# EAGLE design PRO30 (EAGLE 9.3.1)

## Sheet 1 of 2
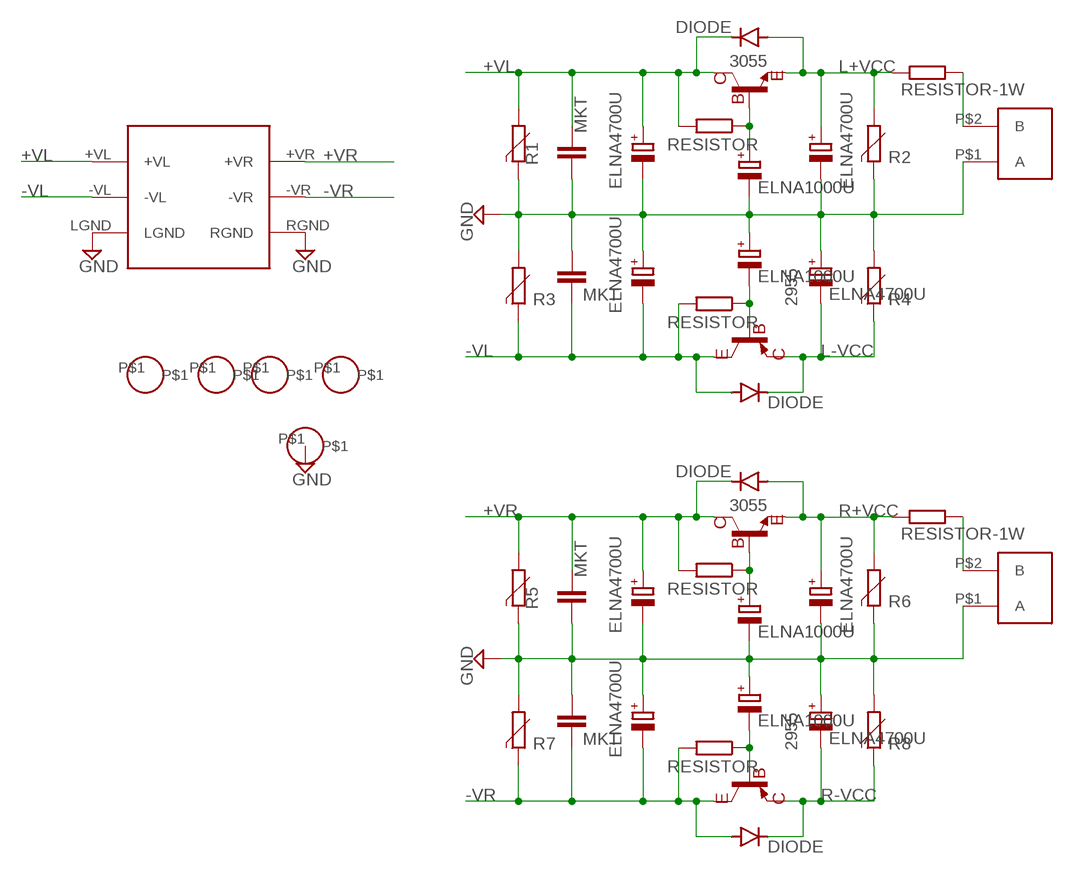
[diagram p0: schematic, sheet 1]

### Parts
R1  NTC  [NTC]
R2  NTC  [NTC]
R3  NTC  [NTC]
R4  NTC  [NTC]
R5  NTC  [NTC]
R6  NTC  [NTC]
R7  NTC  [NTC]
R8  NTC  [NTC]
U$1  INPUT  [INPUT]
U$3  ELNA4700U  [4700U]
U$5  ELNA4700U  [4700U]
U$6  ELNA4700U  [4700U]
U$7  ELNA4700U  [4700U]
U$9  ELNA4700U  [4700U]
U$10  ELNA4700U  [4700U]
U$12  ELNA1000U  [1000U]
U$16  ELNA1000U  [1000U]
U$24  2955  [POWER_TRANS]
U$26  3055  [POWER_TRANS]
U$28  DIODE  [DIODE]
U$29  DIODE  [DIODE]
U$30  MKT  [NTC]
U$34  MKT  [NTC]
U$40  RESISTOR  [RESISTOR]
U$41  OUT2  [OUT2"]
U$42  RESISTOR-1W  [RESISTOR-1W]
U$43  RESISTOR  [RESISTOR]
U$83  ELNA4700U  [4700U]
U$84  ELNA4700U  [4700U]
U$85  ELNA1000U  [1000U]
U$86  ELNA1000U  [1000U]
U$87  2955  [POWER_TRANS]
U$88  3055  [POWER_TRANS]
U$89  DIODE  [DIODE]
U$90  DIODE  [DIODE]
U$91  MKT  [NTC]
U$92  MKT  [NTC]
U$93  RESISTOR  [RESISTOR]
U$94  OUT2  [OUT2"]
U$95  RESISTOR-1W  [RESISTOR-1W]
U$96  RESISTOR  [RESISTOR]
U$101  HOLE  [HOLE]
U$102  HOLE  [HOLE]
U$106  HOLE  [HOLE]
U$107  HOLE  [HOLE]
U$108  HOLE  [HOLE]

### Nets
+VL: R1.2 U$1.+VL U$3.+ U$26.C U$28.C U$30.1 U$40.P$2
+VR: R5.2 U$1.+VR U$9.+ U$88.C U$89.C U$91.1 U$93.P$2
-VL: R3.1 U$1.-VL U$7.- U$24.C U$29.A U$34.2 U$43.P$2
-VR: R7.1 U$1.-VR U$84.- U$87.C U$90.A U$92.2 U$96.P$2
GND: R1.1 R2.1 R3.2 R4.2 R5.1 R6.1 R7.2 R8.2 U$1.LGND U$1.RGND U$3.- U$5.+ U$6.- U$7.+ U$9.- U$10.+ U$12.- U$16.+ U$30.2 U$34.1 U$41.P$1(A) U$83.- U$84.+ U$85.- U$86.+ U$91.2 U$92.1 U$94.P$1(A) U$108.P$1 ; also sheet 2
L+VCC: R2.2 U$6.+ U$26.E U$28.A U$42.P$1 ; also sheet 2
L-VCC: R4.1 U$5.- U$24.E U$29.C ; also sheet 2
N$1: U$85.+ U$88.B U$93.P$1
N$3: U$12.+ U$26.B U$40.P$1
N$4: U$41.P$2(B) U$42.P$2
N$6: U$16.- U$24.B U$43.P$1
N$7: U$94.P$2(B) U$95.P$2
N$38: U$86.- U$87.B U$96.P$1
R+VCC: R6.2 U$83.+ U$88.E U$89.A U$95.P$1 ; also sheet 2
R-VCC: R8.1 U$10.- U$87.E U$90.C ; also sheet 2
Unconnected: U$101.P$1 U$102.P$1 U$106.P$1 U$107.P$1

## Sheet 2 of 2
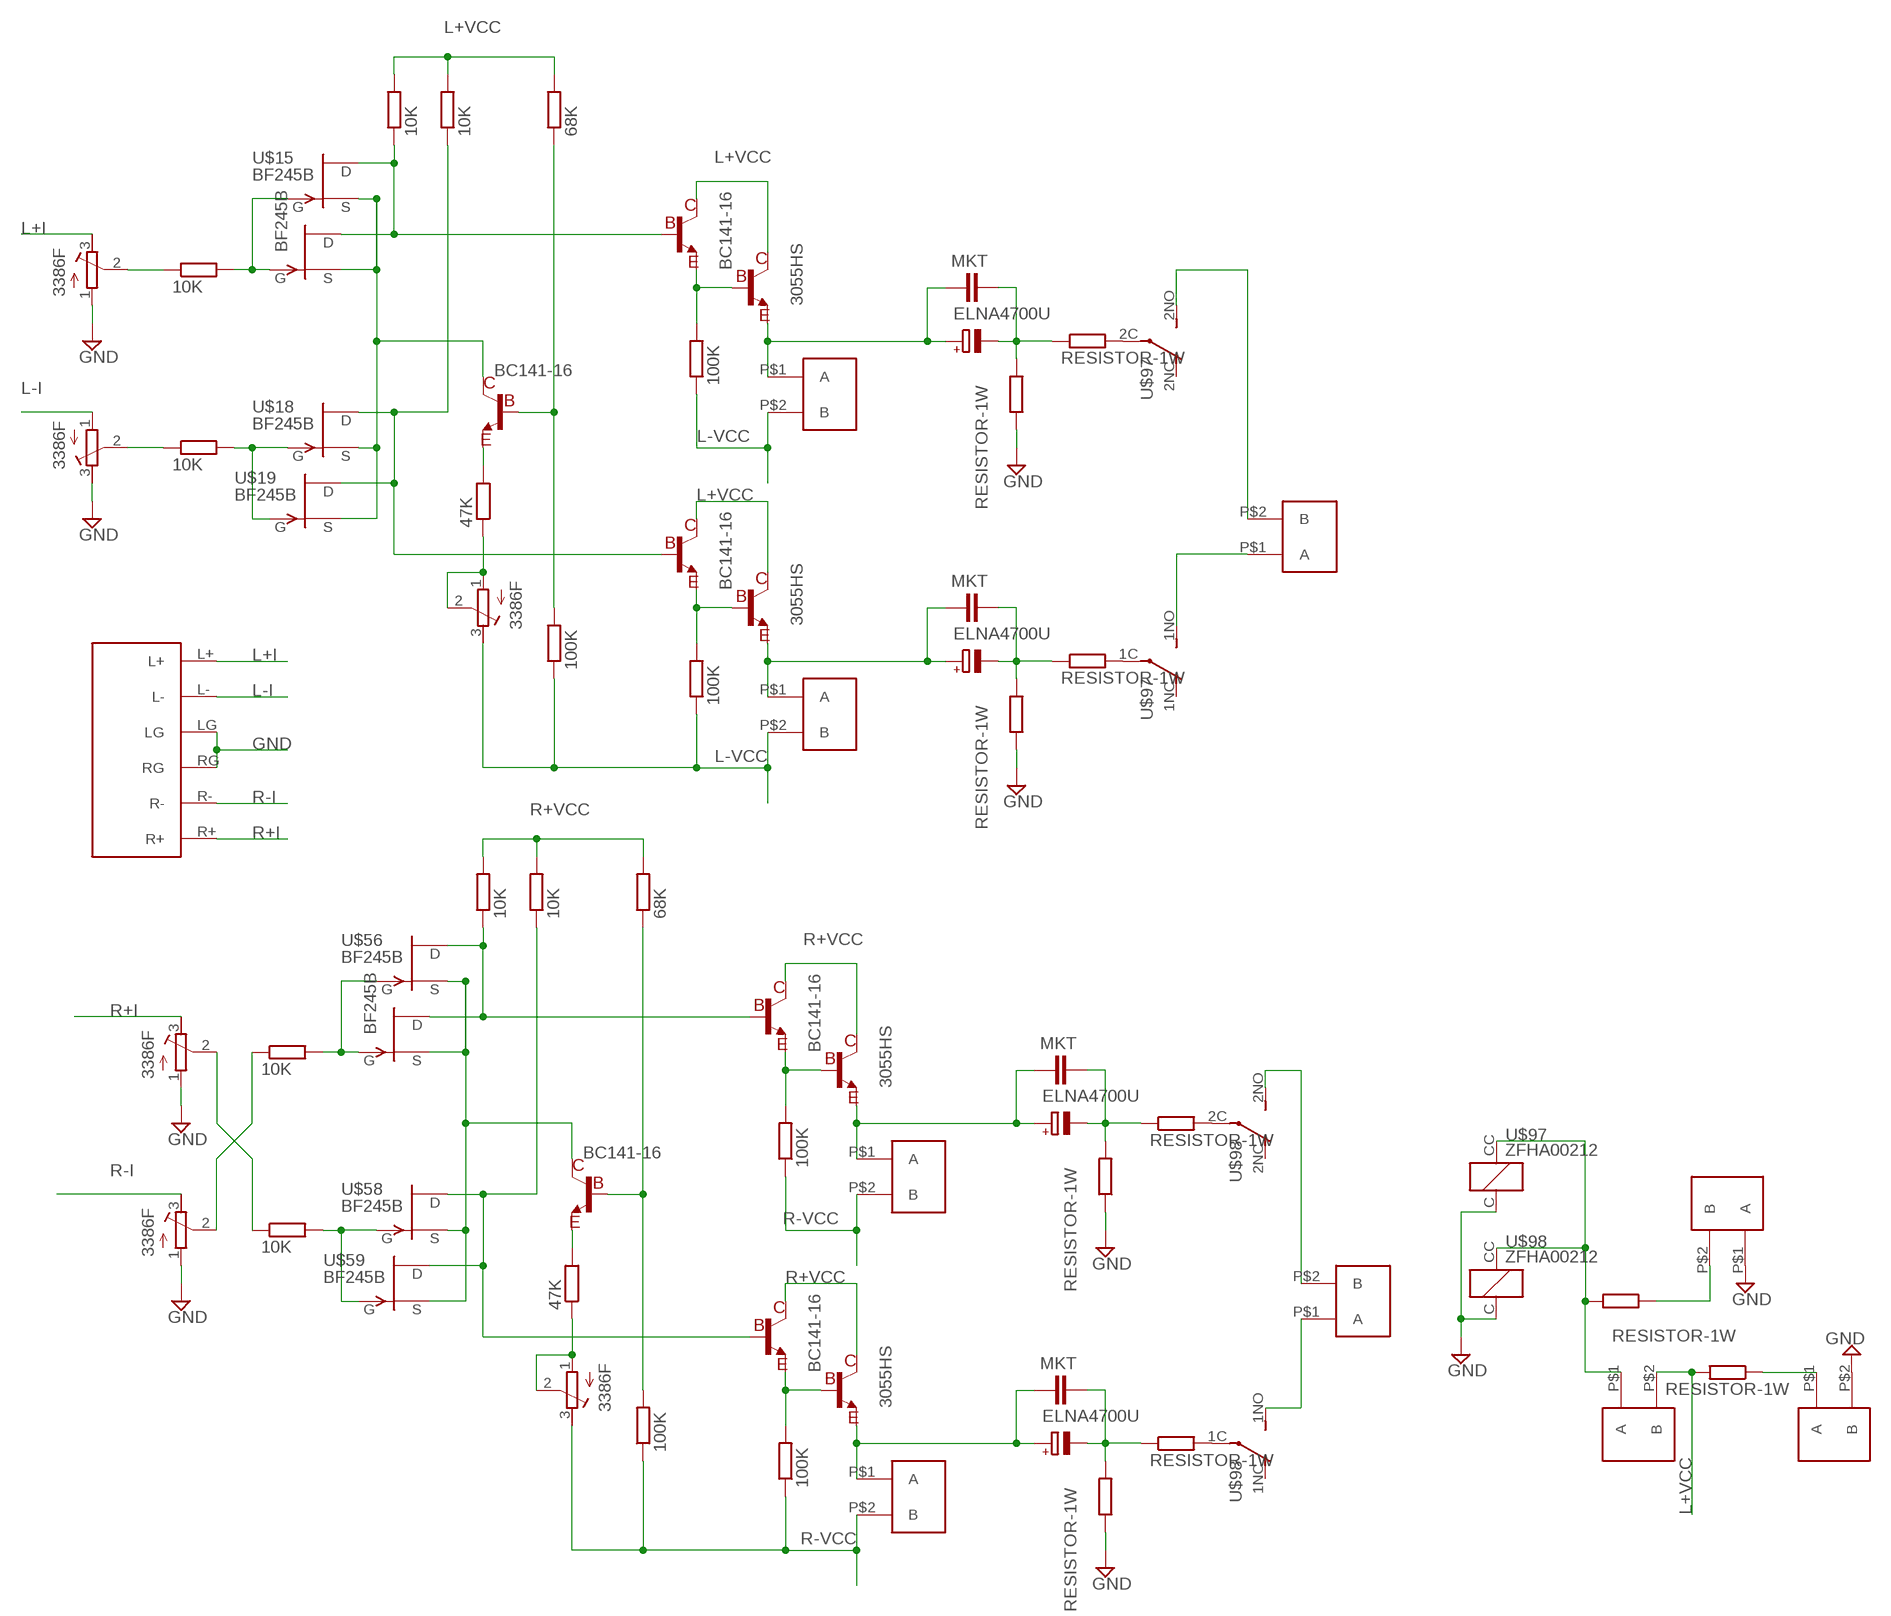
[diagram p1: schematic, sheet 2]

### Parts
DN>L  OUT2  [OUT2"]
DP_SW  OUT2  [OUT2"]
U$2  AUDIO_INPUT  [AUDIO_INPUT]
U$4  3386F  [3386]
U$8  3386F  [3386]
U$11  10K  RESISTOR  [RESISTOR]
U$13  68K  RESISTOR  [RESISTOR]
U$14  BC141-16  [TO39]
U$15  BF245B  [TO39]
U$17  BF245B  [TO39]
U$18  BF245B  [TO39]
U$19  BF245B  [TO39]
U$20  10K  RESISTOR  [RESISTOR]
U$21  10K  RESISTOR  [RESISTOR]
U$22  BC141-16  [TO39]
U$23  BC141-16  [TO39]
U$25  10K  RESISTOR  [RESISTOR]
U$27  47K  RESISTOR  [RESISTOR]
U$31  3386F  [3386]
U$32  3055HS  [POWER_TRANS_WHS]
U$33  3055HS  [POWER_TRANS_WHS]
U$35  OUT3  [OUT3"]
U$36  ELNA4700U  [4700U]
U$37  MKT  [NTC]
U$38  RESISTOR-1W  [RESISTOR-1W]
U$39  RESISTOR-1W  [RESISTOR-1W]
U$44  OUT3  [OUT3"]
U$45  ELNA4700U  [4700U]
U$46  MKT  [NTC]
U$47  RESISTOR-1W  [RESISTOR-1W]
U$48  RESISTOR-1W  [RESISTOR-1W]
U$49  100K  RESISTOR  [RESISTOR]
U$50  100K  RESISTOR  [RESISTOR]
U$51  100K  RESISTOR  [RESISTOR]
U$52  3386F  [3386]
U$53  3386F  [3386]
U$54  10K  RESISTOR  [RESISTOR]
U$55  BC141-16  [TO39]
U$56  BF245B  [TO39]
U$57  BF245B  [TO39]
U$58  BF245B  [TO39]
U$59  BF245B  [TO39]
U$60  10K  RESISTOR  [RESISTOR]
U$61  BC141-16  [TO39]
U$62  47K  RESISTOR  [RESISTOR]
U$63  3386F  [3386]
U$64  3055HS  [POWER_TRANS_WHS]
U$65  OUT3  [OUT3"]
U$66  ELNA4700U  [4700U]
U$67  MKT  [NTC]
U$68  RESISTOR-1W  [RESISTOR-1W]
U$69  RESISTOR-1W  [RESISTOR-1W]
U$70  BC141-16  [TO39]
U$71  3055HS  [POWER_TRANS_WHS]
U$72  OUT3  [OUT3"]
U$73  ELNA4700U  [4700U]
U$74  MKT  [NTC]
U$75  RESISTOR-1W  [RESISTOR-1W]
U$76  RESISTOR-1W  [RESISTOR-1W]
U$77  100K  RESISTOR  [RESISTOR]
U$78  100K  RESISTOR  [RESISTOR]
U$79  100K  RESISTOR  [RESISTOR]
U$80  68K  RESISTOR  [RESISTOR]
U$81  10K  RESISTOR  [RESISTOR]
U$82  10K  RESISTOR  [RESISTOR]
U$97  ZFHA00212  [ZFHA002]
U$98  ZFHA00212  [ZFHA002]
U$99  RESISTOR-1W  [RESISTOR-1W]
U$100  RESISTOR-1W  [RESISTOR-1W]
U$103  OUT2  [OUT2"]
U$104  OUT3  [OUT3"]
U$105  OUT3  [OUT3"]

### Nets
GND: DN>L.P$2(B) U$2.LG U$2.RG U$4.1 U$8.3 U$38.P$1 U$47.P$1 U$52.1 U$53.1 U$68.P$1 U$75.P$1 U$97.C U$98.C U$103.P$1(A) ; also sheet 1
L+I: U$2.L+ U$4.3
L+VCC: DP_SW.P$2(B) U$13.P$2 U$20.P$2 U$22.C/G(C) U$23.C/G(C) U$25.P$2 U$32.C U$33.C U$99.P$2 ; also sheet 1
L-I: U$2.L- U$8.1
L-VCC: U$31.3 U$35.P$2(B) U$44.P$2(B) U$49.P$1 U$50.P$1 U$51.P$1 ; also sheet 1
N$2: U$4.2 U$11.P$1
N$5: U$11.P$2 U$15.C/G(G) U$17.C/G(G)
N$8: U$15.E/D(D) U$17.E/D(D) U$22.B/S(B) U$25.P$1
N$9: U$14.C/G(C) U$15.B/S(S) U$17.B/S(S) U$18.B/S(S) U$19.B/S(S)
N$10: U$13.P$1 U$14.B/S(B) U$49.P$2
N$11: U$8.2 U$21.P$1
N$12: U$18.C/G(G) U$19.C/G(G) U$21.P$2
N$13: U$52.2 U$60.P$1
N$14: U$54.P$2 U$56.C/G(G) U$57.C/G(G)
N$15: U$14.E/D(E) U$27.P$2
N$16: U$27.P$1 U$31.1 U$31.2
N$17: U$22.E/D(E) U$33.B U$51.P$2
N$18: U$18.E/D(D) U$19.E/D(D) U$20.P$1 U$23.B/S(B)
N$19: U$32.E U$44.P$1(A) U$45.+ U$46.1
N$20: U$33.E U$35.P$1(A) U$36.+ U$37.1
N$21: U$36.- U$37.2 U$38.P$2 U$39.P$1
N$22: U$45.- U$46.2 U$47.P$2 U$48.P$1
N$23: U$56.E/D(D) U$57.E/D(D) U$61.B/S(B) U$82.P$1
N$24: U$23.E/D(E) U$32.B U$50.P$2
N$25: U$55.C/G(C) U$56.B/S(S) U$57.B/S(S) U$58.B/S(S) U$59.B/S(S)
N$26: U$58.C/G(G) U$59.C/G(G) U$60.P$2
N$27: U$53.2 U$54.P$1
N$28: U$55.E/D(E) U$62.P$2
N$29: U$62.P$1 U$63.1 U$63.2
N$30: U$64.E U$65.P$1(A) U$66.+ U$67.1
N$31: U$66.- U$67.2 U$68.P$2 U$69.P$1
N$32: U$61.E/D(E) U$64.B U$79.P$2
N$33: U$58.E/D(D) U$59.E/D(D) U$70.B/S(B) U$81.P$1
N$34: U$71.E U$72.P$1(A) U$73.+ U$74.1
N$35: U$73.- U$74.2 U$75.P$2 U$76.P$1
N$36: U$70.E/D(E) U$71.B U$78.P$2
N$37: U$55.B/S(B) U$77.P$2 U$80.P$1
N$39: U$48.P$2 U$97.1C(C)
N$40: U$39.P$2 U$97.2C(C)
N$41: U$97.1NO(NO) U$104.P$1(A)
N$42: U$97.2NO(NO) U$104.P$2(B)
N$43: U$76.P$2 U$98.1C(C)
N$44: U$69.P$2 U$98.2C(C)
N$45: U$98.2NO(NO) U$105.P$2(B)
N$46: U$98.1NO(NO) U$105.P$1(A)
N$47: DP_SW.P$1(A) U$97.CC(CT) U$98.CC(CT) U$100.P$2
N$48: U$100.P$1 U$103.P$2(B)
N$50: DN>L.P$1(A) U$99.P$1
R+I: U$2.R+ U$52.3
R+VCC: U$61.C/G(C) U$64.C U$70.C/G(C) U$71.C U$80.P$2 U$81.P$2 U$82.P$2 ; also sheet 1
R-I: U$2.R- U$53.3
R-VCC: U$63.3 U$65.P$2(B) U$72.P$2(B) U$77.P$1 U$78.P$1 U$79.P$1 ; also sheet 1
Unconnected: U$97.1NC(NC) U$97.2NC(NC) U$98.1NC(NC) U$98.2NC(NC)

## Library data of the parts
DN>L DP_SW U$35 U$41 U$44 U$65 U$72 U$94 U$103-U$105 = pro30:OUT
R1-R8 = pro30:NTC
U$1 = pro30:INPUT
U$2 = pro30:AUDIO_INPUT
U$3 U$5-U$7 U$9 U$10 U$12 U$16 U$36 U$45 U$66 U$73 U$83-U$86 = pro30:ELNA
U$4 U$8 U$31 U$52 U$53 U$63 = pro30:3386F
U$11 U$13 U$20 U$21 U$25 U$27 U$40 U$43 U$49-U$51 U$54 U$60 U$62 U$77-U$82 U$93 U$96 = pro30:RESISTOR
U$14 U$22 U$23 U$55 U$61 U$70 = pro30:BC141-16
U$15 U$17-U$19 U$56-U$59 = pro30:BF245B
U$24 U$87 = pro30:2955
U$26 U$32 U$33 U$64 U$71 U$88 = pro30:3055
U$28 U$29 U$89 U$90 = pro30:DIODE
U$30 U$34 U$37 U$46 U$67 U$74 U$91 U$92 = pro30:MKT
U$38 U$39 U$42 U$47 U$48 U$68 U$69 U$75 U$76 U$95 U$99 U$100 = pro30:RESISTOR-1W
U$97 U$98 = pro30:ZFHA00212
U$101 U$102 U$106-U$108 = pro30:HOLE

## Board
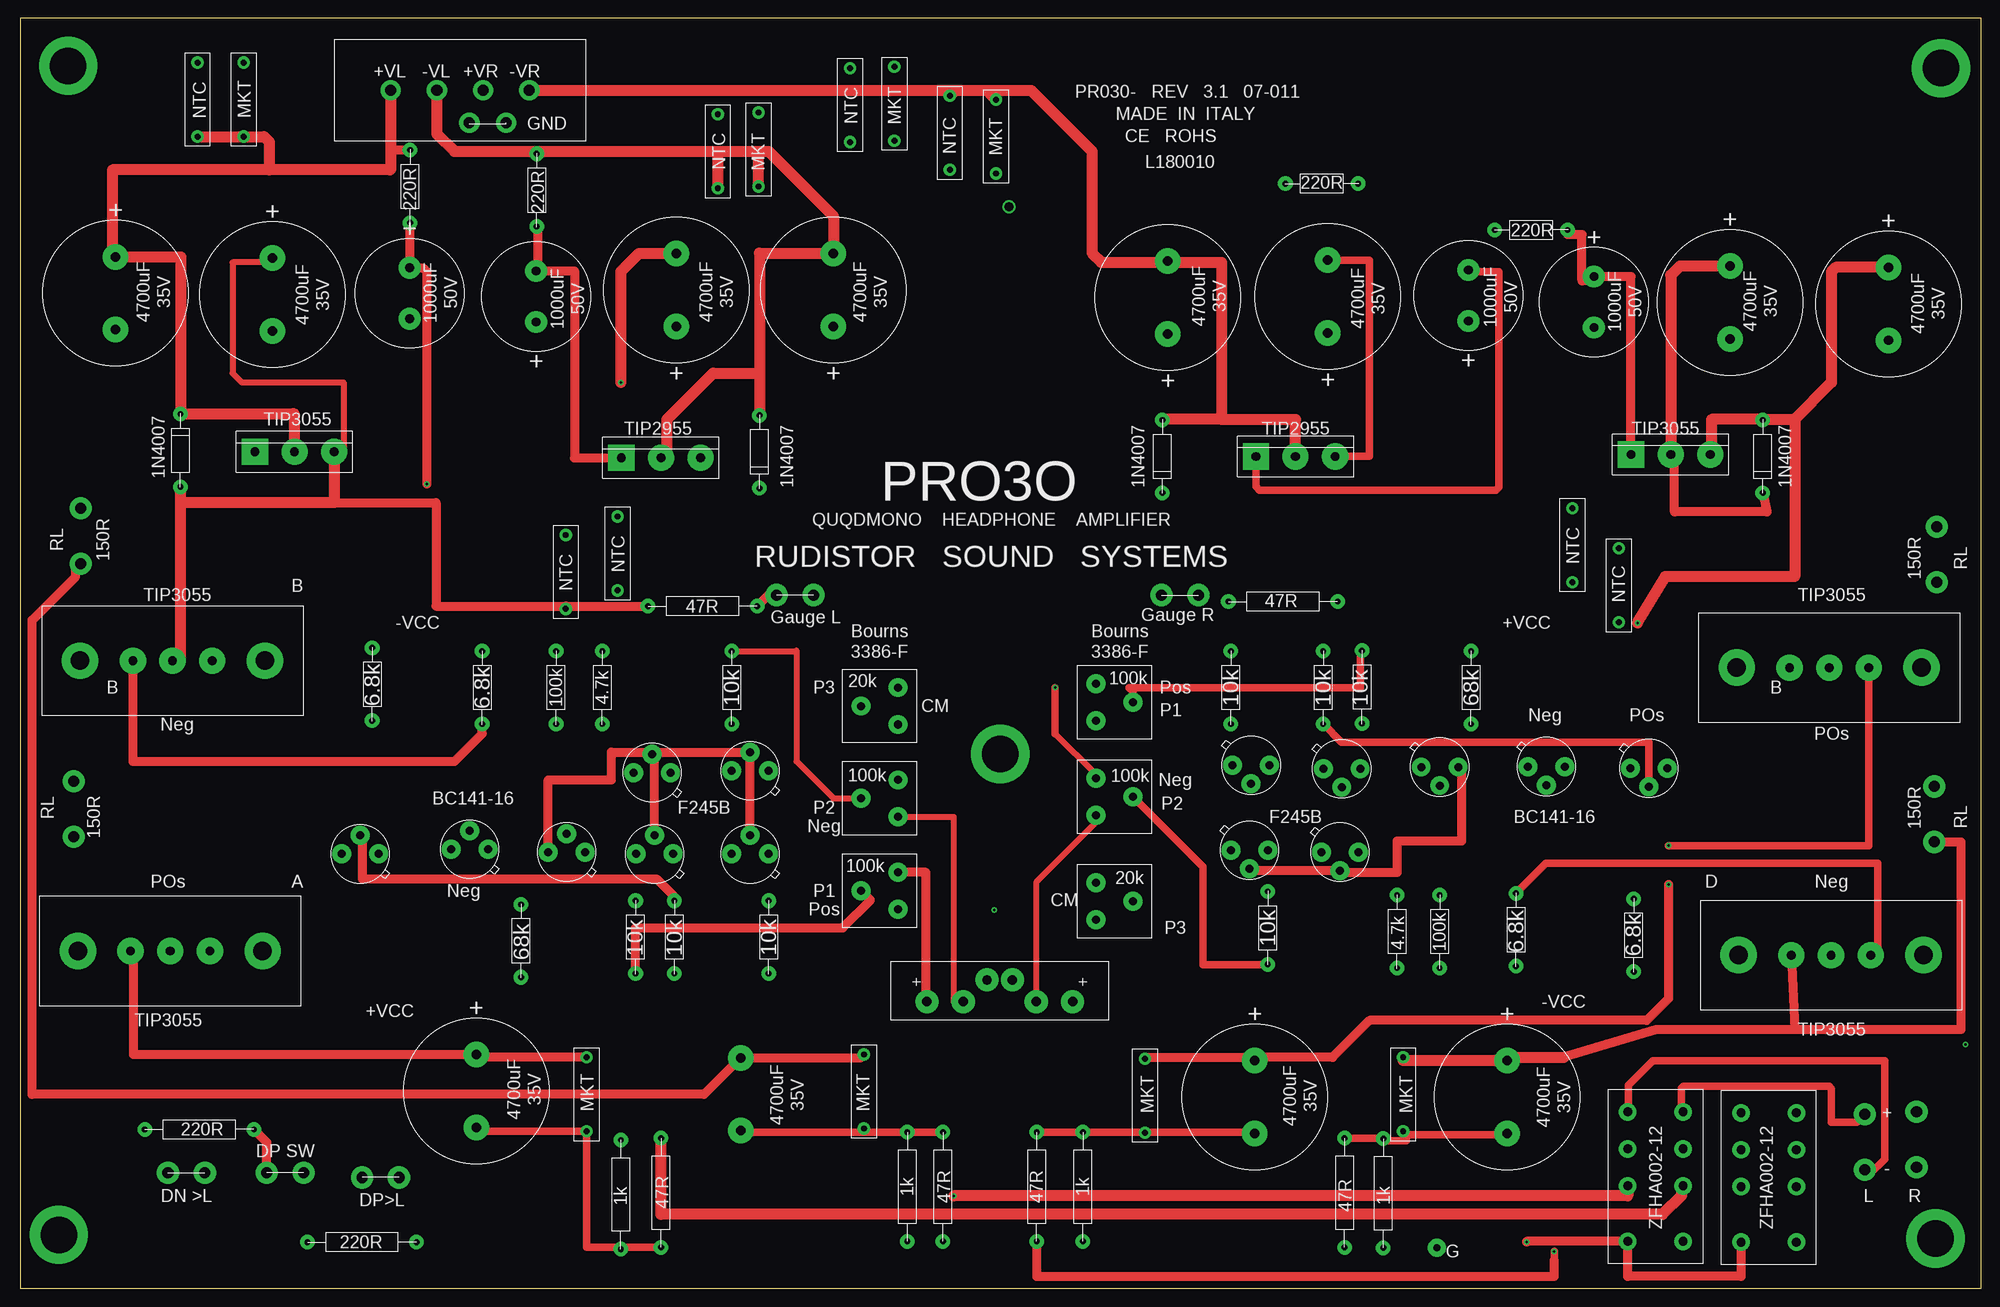
[diagram p2: board, top side]
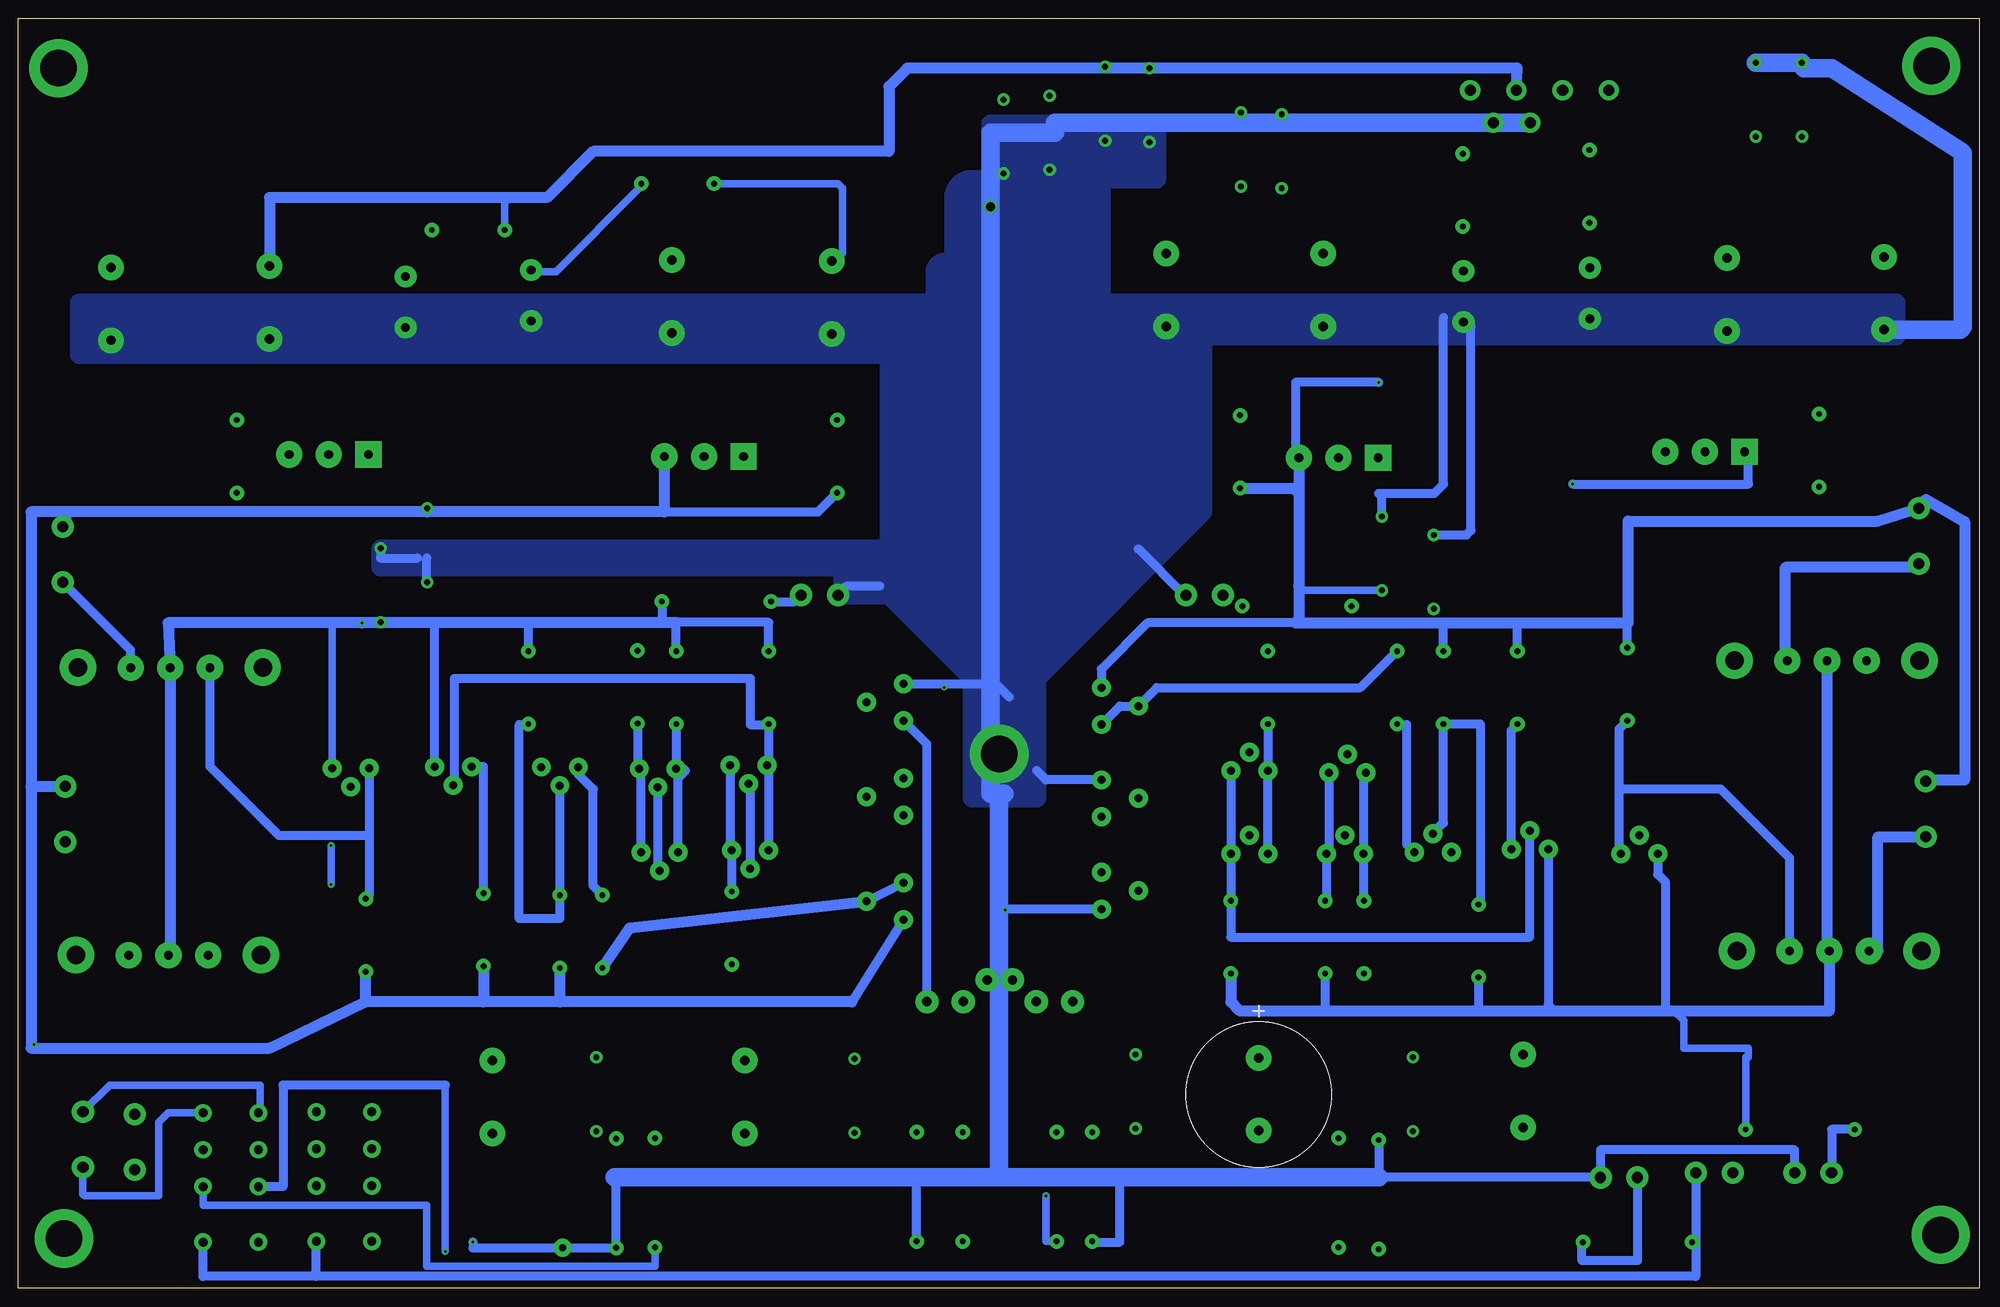
[diagram p3: board, bottom side, seen from below]

Size 269.5 x 174.5 mm. Coordinates in mm from the lower left corner, seen from the top.
Outline: 0,0 269.5,0 269.5,174.5 0,174.5 0,0
Copper layers (1*16): Top 0.035mm / dielectric 1.5mm / Bottom 0.035mm
Design rules "default": minimum track width 6mil, minimum drill 0.35mm, track to track 6mil, track to pad 6mil, pad to pad 6mil, via to via 6mil, smd to smd 6mil, copper to edge 40mil, drill to drill 6mil, minimum pad ring 10mil, minimum via ring 8mil, stop-mask expansion 4mil, vias tented up to drill 0mil, thermal gap 10mil

### Footprints (pad centres in the part's own frame; a part is rotated, then mirrored left to right if it is on the bottom)
OUT2" = drill 1.524 pad 3.048: P$1 0,0; P$2 5.08,0
NTC = drill 0.813 pad 1.676: 1 -5.08,0; 2 5.08,0
INPUT = drill 1.524 pad 2.794: +VL -9.525,0; +VR 3.175,0; -VL -3.175,0; -VR 9.525,0; LGND 1.27,-4.445; RGND 6.35,-4.445
AUDIO_INPUT = drill 1.3 pad 3.2: L+ -10,-1.5; L- -5,-1.5; LG -1.75,1.5; R+ 10,-1.5; R- 5,-1.5; RG 1.75,1.5
4700U = drill 1.3 pad 3.5: + 0,5; - 0,-5
3386 = drill 1.1 pad 2.6: 1 2.54,2.54; 2 0,-2.54; 3 -2.54,2.54
RESISTOR = drill 0.8 pad 2: P$1 -5,0; P$2 5,0
1000U = drill 1.2 pad 3: + 0,3.5; - 0,-3.5
TO39 = drill 1.1 pad 2.6: B/S 2.54,0; C/G 0,2.54; E/D 0,-2.54
POWER_TRANS = drill 1.2 pad 3.6 square: B -5.45,0 | drill 1.2 pad 3.6: C 0,0; E 5.45,0
DIODE = drill 0.8 pad 2: A 5,0; C -5,0
POWER_TRANS_WHS = drill 1.2 pad 3.6: B -5.45,0; C 0,0; E 5.45,0 | drill 2.54 pad 5: P$4 -12.7,0; P$5 12.7,0
OUT3" = drill 1.524 pad 3.048: P$1 0,0; P$2 7.62,0
RESISTOR-1W = drill 0.8 pad 2: P$1 -7.5,0; P$2 7.5,0
ZFHA002 = drill 1.2 pad 2.4: 1C -1.27,3.81; 1NC 3.81,3.81; 1NO 8.89,3.81; 2C -1.27,-3.81; 2NC 3.81,-3.81; 2NO 8.89,-3.81; C -8.89,3.81; CC -8.89,-3.81
HOLE = drill 5 pad 8: P$1 0,0

### Placement (x,y rotation side)
DN>L  20.32,15.88 0 top
DP_SW  38.99,15.88 180 top
R1  24.38,163.32 270 top
R2  74.99,98.42 270 top
R3  101.47,156.46 90 top
R4  82.11,100.97 90 top
R5  120.14,162.75 90 top
R6  219.71,96.58 270 top
R7  134.11,158.24 270 top
R8  213.3,102.11 270 top
U$1  60.45,164.59 0 top
U$2  134.62,40.89 0 top
U$3  13.14,136.72 0 top
U$4  118.11,54.61 270 top
U$5  90.17,137.16 180 top
U$6  34.67,136.53 0 top
U$7  111.76,137.16 180 top
U$8  118.11,67.31 270 top
U$9  234.95,135.45 0 top
U$10  179.71,136.27 180 top
U$11  84.58,48.26 90 top
U$12  53.53,136.72 0 top
U$13  68.83,47.75 270 top
U$14  75.12,59.94 90 top
U$15  87.19,59.69 90 top
U$16  70.93,136.27 180 top
U$17  86.87,70.87 90 top
U$18  100.33,59.69 90 top
U$19  100.33,71.12 90 top
U$20  102.87,48.26 270 top
U$21  97.79,82.55 270 top
U$22  46.74,59.69 90 top
U$23  61.79,60.33 90 top
U$24  88.07,114.11 0 top
U$25  89.92,48.26 270 top
U$26  37.72,114.94 0 top
U$27  80.01,82.55 270 top
U$28  22.03,115.13 270 top
U$29  101.6,114.94 90 top
U$30  30.73,163.32 90 top
U$31  118.11,80.01 270 top
U$32  20.95,86.23 0 top
U$33  20.64,46.35 180 top
U$34  95.89,156.21 270 top
U$35  7.37,62.04 90 top
U$36  62.67,27.11 0 top
U$37  77.85,26.67 270 top
U$38  82.55,12.89 270 top
U$39  88.07,13.14 90 top
U$40  53.59,151.38 90 top
U$41  109.03,95.25 180 top
U$42  93.79,93.73 0 top
U$43  70.99,150.88 90 top
U$44  8.32,99.57 90 top
U$45  99.06,26.67 0 bottom
U$46  115.95,27.05 270 top
U$47  121.92,13.97 90 top
U$48  126.81,13.97 270 top
U$49  73.66,82.55 270 top
U$50  63.5,82.55 270 top
U$51  48.39,82.99 270 top
U$52  150.37,80.52 90 top
U$53  150.37,67.56 90 top
U$54  171.45,49.53 90 top
U$55  195.07,71.63 270 top
U$56  168.91,60.2 270 top
U$57  169.16,71.88 270 top
U$58  181.61,71.37 270 top
U$59  181.36,59.94 270 top
U$60  184.4,82.61 270 top
U$61  209.74,71.69 270 top
U$62  189.23,49.02 90 top
U$63  150.37,53.21 90 top
U$64  248.86,45.78 180 top
U$65  263.02,61.34 90 top
U$66  204.34,26.29 0 top
U$67  190.06,26.67 270 top
U$68  187.32,13.08 90 top
U$69  181.99,13.14 270 top
U$70  223.84,71.44 270 top
U$71  248.6,85.28 0 top
U$72  263.4,97.03 90 top
U$73  169.67,26.29 0 top
U$74  154.56,26.48 270 top
U$75  146.05,13.97 90 top
U$76  139.7,13.97 270 top
U$77  195.07,49.02 90 top
U$78  221.74,48.51 90 top
U$79  205.55,49.28 90 top
U$80  199.39,82.55 90 top
U$81  179.07,82.55 90 top
U$82  166.37,82.55 90 top
U$83  256.73,135.25 0 top
U$84  157.73,136.14 180 top
U$85  216.28,135.51 0 top
U$86  199.01,136.4 180 top
U$87  175.26,114.3 0 top
U$88  226.82,114.55 0 top
U$89  239.46,114.3 90 top
U$90  156.97,114.3 90 top
U$91  114.05,162.56 270 top
U$92  127.76,158.75 90 top
U$93  207.65,145.41 180 top
U$94  156.84,95.25 0 top
U$95  173.55,94.36 180 top
U$96  178.88,151.76 180 top
U$97  224.73,15.37 90 top
U$98  240.28,15.24 90 top
U$99  24.64,21.84 0 top
U$100  46.99,6.35 180 top
U$101  263.21,6.86 0 top
U$102  6.6,167.96 0 top
U$103  52.07,15.24 180 top
U$104  253.49,16.32 90 top
U$105  260.6,24.26 270 top
U$106  5.33,7.37 0 top
U$107  263.97,167.64 0 bottom
U$108  134.68,73.41 0 top

### Tracks (layer width: path | path; a pad name or v marks a point on that pad's centre or on a via)
+VL
  Top 1.27: U$40.P$2 50.93,156.38 50.93,156.21 | U$3.+ 13.14,142.24 12.7,142.24
  Top 1.54: U$1.+VL 50.93,156.21 50.93,153.8 50.8,153.67 34.29,153.67 | 34.29,153.67 12.7,153.67 12.7,142.24 13.97,142.24 | R1.2 U$30.1 33.53,158.24 34.29,157.48 34.29,153.67 | U$26.C 37.72,120.08 37.59,120.21 37.51,120.13 U$28.C 22.1,120.13 22.1,141.72 U$3.+
+VR
  Top 1.016: U$88.C 227.08,114.55 227.33,114.3
  Top 1.27: U$89.C 240.03,106.68 227.33,106.68 227.33,114.3 227.33,115.57
  Top 1.54: U$9.+ 228.08,140.45 226.82,139.19 U$88.C
  Bottom 0.203: R5.2 120.14,167.64 119.38,167.64
  Bottom 1.016: U$91.1 115.57,167.64 | R5.2 119.95,167.64 | U$93.P$2 202.65,149.15 201.93,149.86
  Bottom 1.54: U$1.+VR 63.5,167.64 115.57,167.64 119.38,167.64 147.32,167.64 149.86,165.1 149.86,156.21 190.5,156.21 196.85,149.86 201.93,149.86 234.95,149.86 U$9.+
-VL
  Top 1.016: U$43.P$2 70.99,156.08 71.12,156.21
  Top 1.54: U$1.-VL 57.28,158.62 59.69,156.21 71.12,156.21 95.25,156.21 | 95.25,156.21 101.6,156.21 | 101.6,156.21 102.87,156.21 111.76,147.32 U$7.- 101.68,142.16 101.6,142.24 101.6,125.73 | U$34.2 95.89,155.57 95.25,156.21 | R3.1 101.47,156.08 101.6,156.21 | 101.6,125.73 U$29.A | U$24.C 88.9,114.94 88.9,119.38 95.25,125.73 101.6,125.73
-VR
  Top 1.016: U$84.- 159.85,141.14 160.02,140.97
  Top 1.54: U$1.-VR 128.27,164.59 | 128.27,164.59 133.35,164.59 | 133.35,164.59 138.94,164.59 147.32,156.21 147.32,142.24 148.59,140.97 160.02,140.97 165.1,140.97 165.1,119.38 | U$92.2 128.27,164.34 128.27,164.59 | R7.1 133.35,164.08 133.35,164.59 | U$87.C 175.26,119.38 165.1,119.38 | U$90.A 157.05,119.38 165.1,119.38
  Bottom 1.016: U$96.P$2 156.84,151.76 156.21,151.13 156.21,142.24 157.31,141.14 U$84.-
GND  (via drill 0.35, 1 pad 2.5, 1.2 pad 1.6)
  Top 0.813: U$53.1 147.83,70.61 142.24,76.2
  Top 1.016: 142.24,76.2 v142.24,82.55
  Top 1.27: U$98.C 236.47,1.65 220.92,1.65 U$97.C 207.01,6.48 v207.01,6.35
  Bottom 0.203: v142.24,82.55 142.24,83.06
  Bottom 1.016: R3.2 101.47,160.15 101.6,160.15 | U$34.1 95.89,160.15 95.25,160.15 | U$1.RGND 64.77,160.15 | v194.69,5.59 v194.7,5.58 195.58,5.58
  Bottom 1.27: v207.01,6.35 207.01,5.58 195.58,5.58 U$68.P$1 187.32,15.24 187.58,15.24 | R4.2 82.11,108.78 82.55,109.22 74.93,109.22 73.66,110.49 73.66,133.35 | R2.1 70.48,103.5 69.85,104.14 69.85,132.08 | U$38.P$1 82.55,15.24 | DN>L.P$2 25.4,19.05 52.07,19.05 U$103.P$1 83.82,15.24 | R6.1 219.71,100.33 214.63,100.33 | R8.2 213.36,97.03 213.36,100.33 | U$4.1 134.75,52.07 134.68,52.01 v133.86,52.01 | U$8.3 128.27,69.85 129.54,71.12 | U$94.P$1 155.57,96.52 151.13,96.52 | U$52.1 142.24,83.06 135.13,83.06 133.35,81.28 | U$47.P$1 121.92,6.35 118.11,6.35 118.11,15.24 | U$75.P$1 146.05,15.24 | U$2.LG 134.75,42.39 | U$2.RG 134.75,42.39 | 134.75,42.39 134.75,43.18 | U$41.P$1 109.22,95.25 115.57,101.6
  Bottom 2.54: U$1.LGND 64.77,160.15 95.25,160.15 101.6,160.15 127,160.15 127,158.75 135.89,158.75 v135.89,148.59 135.89,67.94 134.75,67.94 | U$3.- 2.65,131.72 2.29,132.08 2.29,155.96 2.54,156.21 20.32,167.64 24.13,167.64 R1.1 U$30.2 | 133.99,67.94 134.75,67.94 | 187.58,15.24 146.05,15.24 134.75,15.24 | 134.75,67.94 134.75,52.07 134.75,43.18 134.75,15.24 | 82.55,15.24 83.82,15.24 118.11,15.24 134.75,15.24
  pour Bottom (no thermals): 135.89,152.4 138.43,152.4 arc-90 140.97,149.86 140.97,140.97 142.24,140.97 arc-90 143.51,139.7 143.51,135.38 261.11,135.38 261.11,128.27 149.86,128.27 149.86,101.6 219.71,101.6 219.71,99.06 156.21,99.06 156.21,95.25 149.86,95.25 138.43,83.82 138.43,67.31 129.54,67.31 129.54,83.82 106.68,106.68 106.68,130.81 11.43,130.81 11.43,135.38 120.65,135.38 120.65,152.4 113.03,152.4 113.03,160.02 135.89,160.02
L+I
  Top 1.27: U$2.L+ 124.46,39.39 124.46,57.15 U$4.3
L+VCC
  Top 0.813: U$6.+ 34.12,140.97 29.21,140.97 29.21,125.73 30.48,124.46 44.45,124.46 44.45,115.57 43.18,114.3 43.17,114.31 U$26.E
  Top 1.27: 43.17,107.95 57.15,107.95 57.15,93.73 74.99,93.73 | DP_SW.P$2 33.91,20.07 U$99.P$2 | 74.99,93.73 U$42.P$1 | R2.2 74.99,93.73
  Top 1.54: U$28.A 22.04,107.95 | 22.04,107.95 22.04,86.23 U$32.C | U$26.E 43.17,107.95 22.04,107.95
  Bottom 1.016: 41.91,38.1 40.64,36.83 40.64,33.02 31.75,33.02 31.75,31.75 32.14,31.75 U$99.P$2 | U$20.P$2 102.87,43.18
  Bottom 1.27: U$25.P$2 89.92,38.1 | U$13.P$2 68.83,38.1 | U$23.C/G 59.24,38.92 58.42,38.1 | U$22.C/G 44.2,56.9 43.18,55.88 43.18,38.1 | U$33.C 20.64,46.67 20.95,46.99
  Bottom 1.54: U$32.C 20.95,46.99 20.95,45.72 20.32,45.72 | U$33.C 20.64,38.1 41.91,38.1 43.18,38.1 58.42,38.1 68.83,38.1 89.92,38.1 101.6,38.1 102.87,39.37 102.87,43.18
L-I
  Top 0.813: U$8.1 128.27,64.77 128.27,39.37 128.29,39.39 U$2.L-
L-VCC  (via drill 0.35)
  Top 1.54: U$5.- 85.01,142.16 82.55,139.7 v82.55,124.46
  Bottom 1.016: U$35.P$2 7.56,69.85 7.62,69.85 | R4.1 92.89,95.89 93.53,96.52
  Bottom 1.27: v82.55,124.46 93.98,124.46 93.98,114.56 U$24.E | U$51.P$1 48.39,91.44 | 93.98,91.44 114.3,91.44 120.65,85.09 U$31.3 | U$49.P$1 73.66,91.44 | U$50.P$1 63.5,91.44
  Bottom 1.54: U$29.C 94.24,109.94 93.53,109.22 | 7.62,69.85 2.03,69.85 2.03,105.35 7.37,108.39 U$44.P$2 13.97,105.41 48.26,105.41 48.26,91.44 48.39,91.44 63.5,91.44 73.66,91.44 93.98,91.44 93.53,91.89 93.53,96.52 93.53,109.22 | U$24.E 93.53,109.22
N$1
  Top 1.27: U$88.B 221.37,139.01 U$85.+ 216.28,138.43 214.63,138.43 214.63,144.78 212.65,144.78 U$93.P$1
N$2
  Top 1.27: U$11.P$1 84.58,49.53 113.03,49.53 116.84,53.34 U$4.2
N$3  (via drill 0.35)
  Top 1.27: U$40.P$1 53.53,146.32 U$12.+ 55.36,140.22 55.88,139.7 v55.88,110.49
  Bottom 1.27: v55.88,110.49 31.75,110.49 31.75,114.42 U$26.B
N$4
  Top 1.27: U$42.P$2 102.81,95.25 U$41.P$2
N$5
  Bottom 1.27: U$17.C/G 84.64,70.87 U$15.C/G 84.64,53.32 U$11.P$2
N$6
  Top 1.27: U$24.B 76.2,114.11 76.2,139.77 U$16.- 71.12,139.77 71.12,145.75 U$43.P$1
N$7
  Bottom 1.27: U$95.P$2 162.81,94.36 U$94.P$2
N$8
  Top 1.016: U$25.P$1 89.92,53.78
  Top 1.27: U$22.B/S 47.05,61.91 47.05,56.26 87.44,56.26 89.92,53.78
  Bottom 1.016: U$25.P$1 89.72,53.45 89.72,54.61
  Bottom 1.27: U$17.E/D 89.41,59.69 U$15.E/D 89.72,54.61 89.72,53.34
N$9
  Top 1.27: U$14.C/G 72.58,69.85 81.28,69.85 81.28,73.66 86.87,73.66 U$17.B/S 87.19,73.72 87.19,73.66 | 87.19,73.66 U$19.B/S U$18.B/S | U$15.B/S 87.19,73.66
N$10
  Bottom 1.27: U$13.P$1 68.58,52.75 68.58,77.55 U$49.P$2 73.66,63.94 U$14.B/S
N$11
  Top 0.813: U$21.P$1 106.6,87.55 106.68,87.63 106.68,72.39 111.76,67.31 U$8.2
N$12
  Bottom 1.27: U$18.C/G U$19.C/G U$21.P$2
N$13
  Top 1.016: U$52.2 152.91,82.04 152.4,82.55 184.15,82.55 184.15,87.61 U$60.P$1
N$14
  Bottom 1.27: U$57.C/G 171.7,61.21 171.45,60.96 U$56.C/G U$54.P$2
N$15
  Bottom 1.27: U$27.P$2 79.93,77.47 78.74,77.47 78.74,61.02 U$14.E/D
N$16
  Bottom 1.27: U$31.1 118.11,80.01 U$31.2 113.03,82.55 85.09,82.55 80.01,87.63 U$27.P$1
N$17
  Bottom 1.27: U$51.P$2 49.53,76.85 49.53,68.58 | 49.53,68.58 49.53,59.94 U$22.E/D | U$33.B 26.09,59.11 35.56,68.58 49.53,68.58
N$18
  Bottom 1.27: U$19.E/D U$18.E/D U$20.P$1 102.87,48.26 61.78,48.26 U$23.B/S
N$19
  Top 1.27: U$44.P$1 7.62,98.87 7.62,97.79 1.65,91.82 1.65,26.67 93.98,26.67 98.98,31.67 U$45.+ 115.49,31.67 U$46.1
  Bottom 1.016: U$32.E 26.54,86.23 26.67,86.36
  Bottom 1.54: U$44.P$1 8.32,99.06 26.67,99.06 26.67,86.36
N$20
  Top 1.27: U$37.1 63.04,31.75 U$36.+ 15.6,32.11 15.6,46.35 U$33.E 15.19,46.94
  Bottom 1.54: U$33.E 13.97,46.35 13.97,62.04 U$35.P$1
N$21
  Top 1.016: U$39.P$1 82.55,5.64 77.85,5.64 U$37.2 63.5,21.59 63.5,22.11 U$36.-
  Top 1.27: U$38.P$2 82.55,5.64
N$22
  Top 1.016: U$48.P$1 U$47.P$2 115.57,21.47 | 115.57,21.47 97.91,21.47 97.79,21.59 97.87,21.67 U$45.- | U$46.2 115.95,21.85 115.57,21.47
N$23
  Bottom 1.27: U$61.B/S 209.55,69.15 209.55,83.82 168.91,83.82 168.91,77.47 166.37,77.47 | 166.37,77.47 166.37,72.14 | 166.37,72.14 U$56.E/D | U$82.P$1 166.37,77.47 | U$57.E/D 166.37,72.14
N$24
  Top 1.27: U$32.B 15.51,72.39 59.69,72.39 63.5,76.2 U$50.P$2
  Bottom 1.27: U$23.E/D 64.33,76.64 63.5,77.47 U$50.P$2
N$25
  Top 1.27: U$55.C/G 198.12,71.63 198.12,61.47 189.23,61.47 189.23,57.15 181.61,57.15 U$59.B/S 169.16,57.4 U$56.B/S
  Bottom 1.27: U$59.B/S 181.61,57.4 U$58.B/S | U$57.B/S 168.91,69.09 U$56.B/S
N$26
  Bottom 1.27: U$60.P$2 184.4,71.63 U$58.C/G 183.9,71.12 U$59.C/G
N$27
  Top 1.016: U$54.P$1 171.37,44.45 162.56,44.45 162.56,57.91 U$53.2
N$28
  Bottom 1.27: U$62.P$2 190.5,55.29 190.5,68.58 192.53,70.61 U$55.E/D
N$29
  Bottom 1.27: U$63.2 U$63.1
  Bottom 1.54: U$62.P$1 185.42,49.53 U$63.2
N$30
  Top 1.27: U$65.P$1 266.7,61.34 266.7,35.56 243.84,35.56 | 243.84,35.56 224.79,35.56 212.09,31.75 | U$64.E 243.84,35.56 | U$66.+ 204.34,31.62 204.47,31.75
  Top 1.54: U$66.+ 190.06,31.29 U$67.1 | 204.47,31.75 212.09,31.75
N$31
  Top 1.016: U$69.P$1 187.26,20.64 U$68.P$2 187.59,20.32 190.5,20.32 190.5,21.14 | 190.5,21.14 U$67.2 | 190.5,21.14 204.2,21.14 U$66.-
N$32
  Top 1.016: U$64.B 255.27,45.78 255.27,58.42 209.69,58.42 U$79.P$2
  Bottom 1.27: U$79.P$2 205.55,71.69 U$61.E/D
N$33
  Top 1.016: U$70.B/S 223.84,75.06 181.56,75.06 U$81.P$1
  Bottom 1.016: U$81.P$1 179.07,77.47
  Bottom 1.27: U$59.E/D 178.82,70.1 177.8,71.12 178.05,71.37 U$58.E/D 179.07,77.47
N$34  (via drill 0.35)
  Top 1.016: U$71.E 254.05,60.83 v226.5,60.83
  Top 1.27: v226.5,55.5 226.5,39.81 223.52,36.83 185.42,36.83 180.34,31.75 169.67,31.75 | 169.67,31.75 U$73.+ | U$74.1 154.75,31.75 169.67,31.75
  Bottom 1.016: v226.5,60.83 v226.5,55.5
  Bottom 1.27: U$71.E 254.05,87.68 U$72.P$1
N$35
  Top 1.016: U$76.P$1 U$75.P$2 154.94,21.47 | U$73.- 169.49,21.47 154.94,21.47 | U$74.2 154.87,21.4 154.94,21.47
N$36
  Bottom 1.27: U$71.B 243.15,71.7 233.68,62.23 221.3,62.23 | U$70.E/D 221.3,62.23 | 221.3,62.23 221.3,53.96 U$78.P$2
N$37
  Bottom 1.27: U$55.B/S U$77.P$2 195.07,50.8 200.66,50.8 200.66,77.47 199.47,77.47 U$80.P$1
N$38
  Top 1.016: U$86.- 199.01,139.7 203.2,139.7 203.2,110.05 202.82,109.67 170.31,109.67 169.8,110.17 U$87.B
  Bottom 1.016: U$86.- 198.81,139.7 195.58,139.7 184.15,151.13 184.15,151.49 U$96.P$1
N$39  (via drill 0.35)
  Top 1.54: U$97.1C 220.92,12.7 v128.27,12.7
  Bottom 1.016: v128.27,12.7 128.27,6.47 U$48.P$2
N$40
  Top 1.54: U$97.2C 228.28,13.84 228.28,12.76 225.68,10.16 88.08,10.16 U$39.P$2
N$41
  Top 1.016: 220.98,24.32 220.98,27.94 224.34,31.3 256.22,31.3 256.22,17.78 254.19,15.75 253.62,16.32 U$104.P$1
  Top 1.27: U$97.1NO 220.98,24.32
N$42
  Top 1.016: U$104.P$2 252.41,22.86 248.92,22.86 248.92,27.43 248.6,27.75 228.54,27.75 228.28,27.5 228.28,23.69 228.54,23.94 | 228.54,23.94 229.04,23.94 228.79,23.69 228.54,23.94 | 228.54,23.94 U$97.2NO
N$43  (via drill 0.35)
  Top 1.016: 210.82,3.81 v210.82,5.08
  Top 1.27: U$76.P$2 139.7,1.65 210.82,1.65 210.82,3.81
  Bottom 1.016: v210.82,5.08 210.82,27.94
  Bottom 1.27: U$98.1C 233.11,13.97 233.11,27.94 210.82,27.94
N$44
  Bottom 1.016: U$98.2C 244.09,11.43 213.36,11.43 213.36,3.05 181.99,3.05 U$69.P$2
N$45
  Bottom 1.016: U$98.2NO 248.92,24.13 250.19,22.86 250.19,12.7 260.35,12.7 260.6,12.95 U$105.P$2
N$46
  Bottom 1.016: U$105.P$1 256.92,27.94 236.22,27.94 236.22,24.13
  Bottom 1.27: U$98.1NO 236.22,24.13
N$47
  Bottom 1.27: DP_SW.P$1 38.99,6.35 | 38.99,6.35 38.99,1.65 228.6,1.65 | U$98.CC 244.09,1.65 228.6,1.65 | U$97.CC 228.6,6.48 228.6,1.65 | U$100.P$2 38.99,6.35
N$48
  Bottom 1.27: U$100.P$1 54.61,6.35 54.61,3.81 46.99,3.81 U$103.P$2
N$50
  Bottom 1.27: U$99.P$1 20.32,21.84 DN>L.P$1
R+I
  Bottom 1.27: U$2.R+ 144.62,74.77 U$52.3
R+VCC  (via drill 0.35)
  Top 1.54: U$83.+ 249.47,140.25 248.92,139.7 248.92,124.46 243.84,119.38 | 243.84,119.38 239.54,119.38 U$89.A 239.38,119.38 232.41,119.38 232.41,114.69 U$88.E | 243.84,119.38 243.84,97.79 226.06,97.79 v222.25,91.44
  Bottom 1.016: U$70.C/G 226.38,91.44 226.06,91.44
  Bottom 1.27: U$82.P$2 166.37,91.5 179.07,91.5 U$81.P$2 | U$80.P$2 199.39,91.5 | U$61.C/G 212.28,91.31 212.09,91.5 | U$95.P$1 181.05,92.07 181.61,91.5
  Bottom 1.54: U$64.C 248.6,46.04 U$71.C 248.92,91.44 226.06,91.44 v222.25,91.44 219.77,91.44 R6.2 212.09,91.5 199.39,91.5 181.61,91.5 179.07,91.5
R-I
  Top 0.813: U$2.R- 139.7,39.47 139.7,55.88 147.83,64.01 U$53.3
R-VCC  (via drill 0.35)
  Top 1.016: U$10.- 185.42,141.27 185.42,114.3 U$87.E
  Bottom 0.2: v267.33,33.53 267.71,33.15 267.71,33.02
  Bottom 1.27: U$63.3 154.94,39.37 | 180.71,106.68 159.59,106.68 U$90.C | R8.1 213.3,106.74 213.36,106.68
  Bottom 1.54: 262.89,106.68 213.36,106.68 180.71,106.68 U$87.E | 262.89,106.68 267.71,106.68 267.71,68.96 | 267.71,68.96 U$65.P$2 | U$72.P$2 262.89,104.65 262.89,106.68 | 154.94,39.37 195.07,39.37 | 195.07,39.37 205.55,39.37 | 205.55,39.37 221.74,39.37 | 221.74,39.37 U$78.P$1 | U$79.P$1 205.55,39.37 | U$77.P$1 195.07,39.37 | 267.71,68.96 267.71,33.02 234.95,33.02 221.74,39.37

### Text on the board
tPlace: +VL | -VL | +VR | -VR | PR030- REV 3.1 07-011 | NTC | MKT | NTC | MKT | MADE IN ITALY | GND | NTC | MKT | CE ROHS | NTC | MKT | L180010 | 220R | 220R | 220R | 220R | 4700uF / 35V | 4700uF / 35V | 1000uF / 50V | 4700uF / 35V | 4700uF / 35V | 1000uF / 50V | 4700uF / 35V | 4700uF / 35V | 1000uF / 50V | 1000uF / 50V | 4700uF / 35V | 4700uF / 35V | TIP3055 | TIP2955 | TIP2955 | TIP3055 | 1N4007 | 1N4007 | 1N4007 | 1N4007 | PRO3O | QUQDMONO HEADPHONE AMPLIFIER | RL | 150R | NTC | NTC | RUDISTOR SOUND SYSTEMS | 150R | RL | NTC | B | NTC | TIP3055 | TIP3055 | 47R | 47R | Gauge R | Gauge L | -VCC | +VCC | Bourns / 3386-F | Bourns / 3386-F | 100k | B | 6.8k | 6.8k | 100k | 4.7k | 10k | P3 | 20k | Pos | 10k | 10k | 10k | 68k | B | CM | P1 | Neg | POs | Neg | POs | 100k | 100k | Neg | BC141-16 | P2 | RL | F245B | P2 | 150R | 150R | F245B | BC141-16 | RL | Neg | 100k | POs | A | 20k | D | Neg | Neg | P1 | CM | Pos | P3 | 10k | 4.7k | 100k | 6.8k | 6.8k | 68k | 10k | 10k | 10k | -VCC | +VCC | TIP3055 | TIP3055 | 4700uF / 35V | MKT | 4700uF / 35V | MKT | MKT | MKT | 4700uF / 35V | 4700uF / 35V | + | 220R | DP SW | - | ZFHA002-12 | ZFHA002-12 | 1k | 47R | 47R | 1k | DN >L | 1k | 47R | 47R | 1k | L | R | DP>L | 220R | G